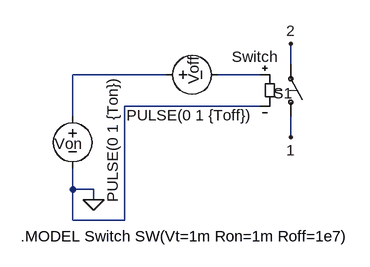
[diagram p0: schematic SwTime.asc]
SwTime.asc, the LTspice schematic file:
Version 4
SHEET 1 880 1444
WIRE 224 1152 224 1120
WIRE 32 1168 -112 1168
WIRE 176 1168 112 1168
WIRE 176 1216 -32 1216
WIRE -112 1232 -112 1168
WIRE 224 1264 224 1232
WIRE -112 1344 -112 1312
WIRE -80 1344 -112 1344
WIRE -80 1360 -80 1344
WIRE -112 1392 -112 1344
WIRE -32 1392 -32 1216
WIRE -32 1392 -112 1392
FLAG 224 1264 1
FLAG 224 1120 2
FLAG -80 1360 0
SYMBOL voltage -112 1216 R0
WINDOW 3 62 -45 VRight 0
WINDOW 123 0 0 Left 0
WINDOW 39 78 67 Left 0
WINDOW 0 -28 58 Left 0
SYMATTR Value PULSE(0 1 {Ton})
SYMATTR InstName Von
SYMBOL sw 224 1248 M180
WINDOW 0 -27 52 Left 0
WINDOW 3 -91 108 Left 0
SYMATTR InstName S1
SYMATTR Value Switch
SYMBOL voltage 16 1168 M90
WINDOW 3 62 -45 VRight 0
WINDOW 123 0 0 Left 0
WINDOW 39 78 67 Left 0
WINDOW 0 -28 58 Left 0
SYMATTR Value PULSE(0 1 {Toff})
SYMATTR InstName Voff
TEXT -192 1416 Left 0 !.MODEL Switch SW(Vt=1m Ron=1m Roff=1e7)

The netlist it stands for:
* SwTime.asc
Von N001 0 PULSE(0 1 {Ton})
S1 1 2 N002 0 Switch
Voff N001 N002 PULSE(0 1 {Toff})
.MODEL Switch SW(Vt=1m Ron=1m Roff=1e7)
.backanno
.end